# EAGLE design General module (EAGLE 9.1.3)
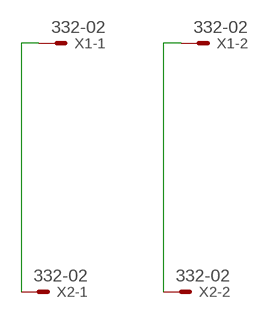
[diagram p0: schematic, sheet 1]

## Parts
X1  332-02  [332-02]
X2  332-02  [332-02]

## Nets
N$1: X1.1 X2.1
N$2: X1.2 X2.2

## Library data of the parts
X1 X2 = con-garry:332-02: 2 Pin - 2mm Dual Row Source: www.mpe-connector.de / garry_shortform_2012.pdf

## Board
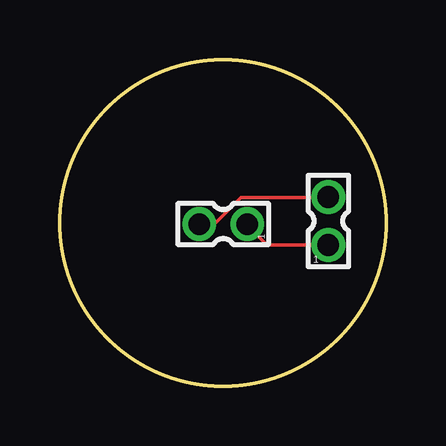
[diagram p1: board, top side]

Size 13.6 x 13.6 mm. Coordinates in mm from the lower left corner, seen from the top.
Outline: circle at 6.8,6.8 radius 6.8
Copper layers (1*16): Top 0.035mm / dielectric 1.5mm / Bottom 0.035mm
Design rules "default": minimum track width 6mil, minimum drill 0.35mm, track to track 6mil, track to pad 6mil, pad to pad 6mil, via to via 6mil, smd to smd 6mil, copper to edge 40mil, drill to drill 6mil, minimum pad ring 10mil, minimum via ring 8mil, stop-mask expansion 4mil, vias tented up to drill 0mil, thermal gap 10mil

### Footprints (pad centres in the part's own frame; a part is rotated, then mirrored left to right if it is on the bottom)
332-02 = drill 0.9 pad 1.27: 1 0,-1; 2 0,1

### Placement (x,y rotation side)
X1  11.2,6.88 0 top
X2  6.81,6.75 90 top

### Tracks (layer width: path | path; a pad name or v marks a point on that pad's centre or on a via)
N$1
  Top 0.152: X1.1 11.07,5.89 8.63,5.89 7.87,6.65 X2.1
N$2
  Top 0.152: X2.2 5.89,6.8 6.5,6.8 7.56,7.87 11.07,7.87 X1.2

### Text on the board
bNames: Module